# Altium schematic sheet Slave_Schematic.SchDoc
size A4 portrait; SheetNumber: 1; SheetTotal: 2
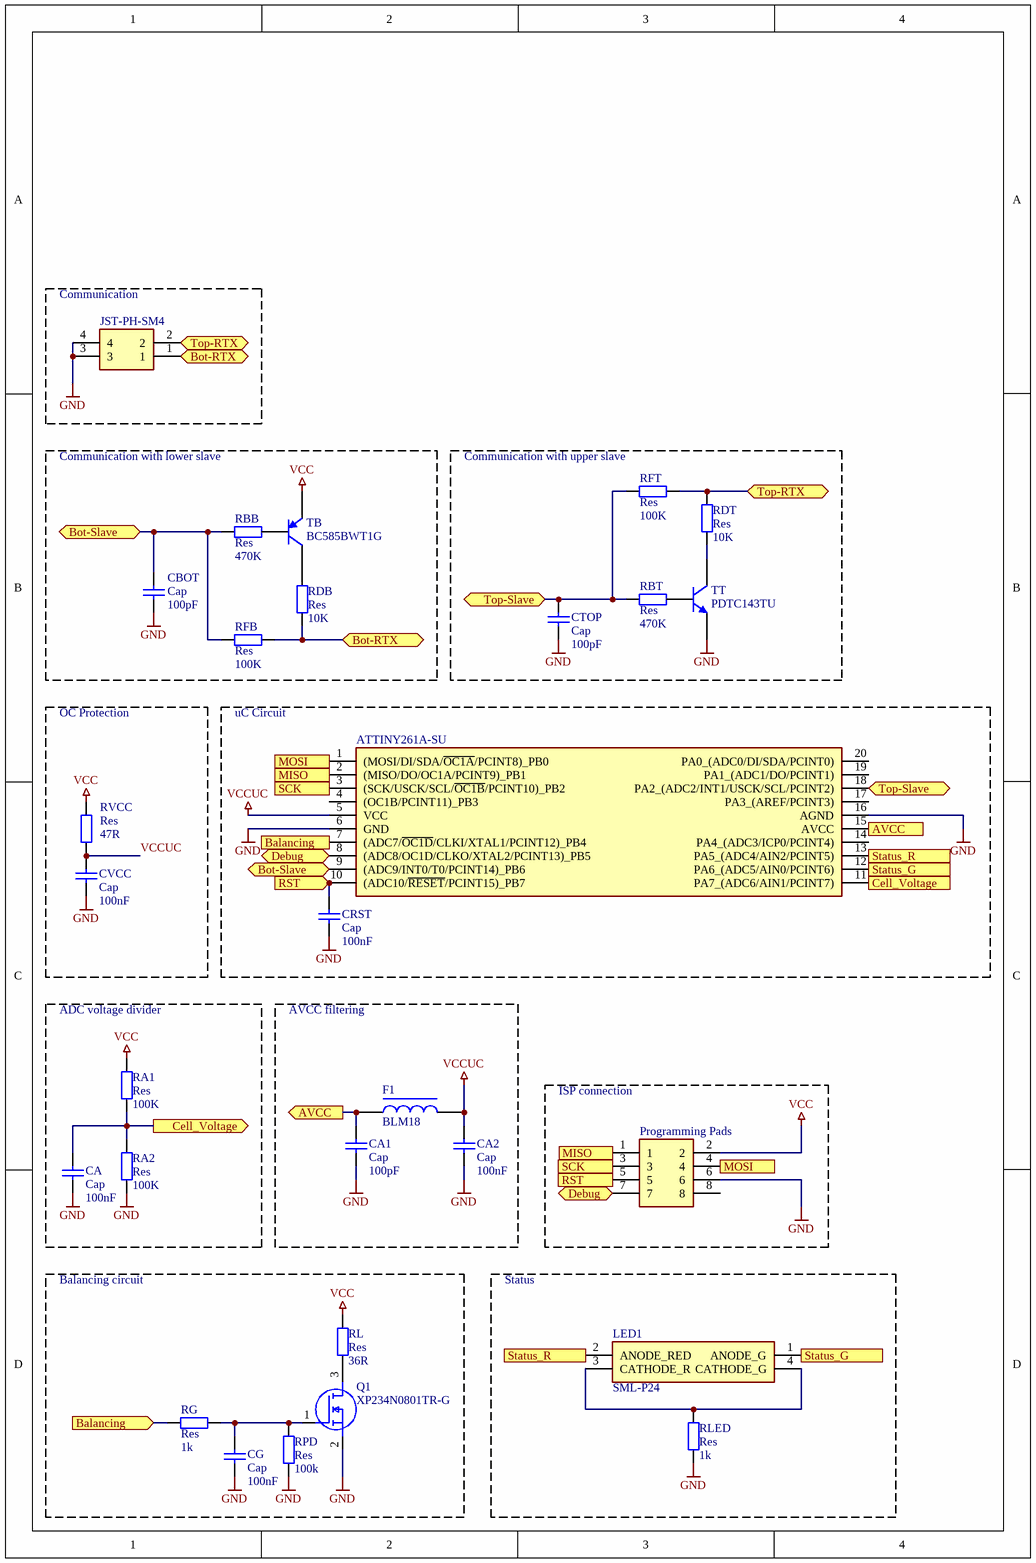
[diagram p0: Slave_Schematic.SchDoc]

## Parts
ATTINY261A-SU  ATTINY261A-SU  [TSSOP-20T (MO-153 AC)]  (value not drawn)
CA  Cap  value 100nF  [0603]
CA1  Cap  value 100pF  [0603]
CA2  Cap  value 100nF  [0603]
CBOT  Cap  value 100pF  [0603]
CG  Cap  value 100nF  [0603]
CRST  Cap  value 100nF  [0603]
CTOP  Cap  value 100pF  [0603]
CVCC  Cap  value 100nF  [0603]
F1  BLM18  [0603 - BLM18AG102BH1D]
JST-PH-SM4  B2B-PH-SM4  [JST-PHR]  (value not drawn)
LED1  SML-P24  [1010 LED]
Programming_Pads  Connector 2x4  [Pads 2X4]  (value not drawn)
Q1  XP234N0801TR-G  [SOT-23 (TO-236)]
RA1  Res  value 100K  [0603]
RA2  Res  value 100K  [0603]
RBB  Res  value 470K  [0603]
RBT  Res  value 470K  [0603]
RDB  Res  value 10K  [0603]
RDT  Res  value 10K  [0603]
RFB  Res  value 100K  [0603]
RFT  Res  value 100K  [0603]
RG  Res  value 1k  [0603]
RL  Res  value 36R  [1020 (Reversed)]
RLED  Res  value 1k  [0603]
RPD  Res  value 100k  [0603]
RVCC  Res  value 47R  [0603]
TB  BC585BWT1G  [SOT-323 (SC-70)]
TT  PDTC143TU  [SOT-323 (SC-70)]

## Blocks framed on the sheet
Communication: JST-PH-SM4
Communication with lower slave: CBOT RBB RDB RFB TB
Communication with upper slave: CTOP RBT RDT RFT TT
OC Protection: CVCC RVCC
uC Circuit: ATTINY261A-SU CRST
ADC voltage divider: CA RA1 RA2
AVCC filtering: CA1 CA2 F1
ISP connection: Programming_Pads
Balancing circuit: CG Q1 RG RL RPD
Status: LED1 RLED

## Ports
AVCC (in), AVCC (out), Balancing (in), Balancing (out), Bot-RTX (bidir), Bot-Slave (bidir), Cell_Voltage (in), Cell_Voltage (out), Debug (bidir), MISO (in), MISO (out), MOSI (in), MOSI (out), RST (in), RST (out), SCK (in), SCK (out), Status_G (in), Status_G (out), Status_R (in), Status_R (out), Top-RTX (bidir), Top-Slave (bidir)

## Nets
GND: ATTINY261A-SU.6(GND) ATTINY261A-SU.16(AGND) CA.1 CA1.1 CA2.1 CBOT.1 CG.1 CRST.1 CTOP.1 CVCC.1 JST-PH-SM4.3 JST-PH-SM4.4 Programming_Pads.6 Q1.2(S) RA2.1 RLED.1 RPD.1 TT.3(E)
VCC: Programming_Pads.2 RA1.2 RL.2 RVCC.2 TB.3(E)
VCCUC: ATTINY261A-SU.5(VCC) CA2.2 CVCC.2 F1.2 RVCC.1
AVCC: ATTINY261A-SU.15(AVCC) CA1.2 F1.1 ; port AVCC
Balancing: ATTINY261A-SU.7((ADC7/~{OC1D}/CLKI/XTAL1/PCINT12)_PB4) RG.1 ; port Balancing
Bot-RTX: JST-PH-SM4.1 RDB.1 RFB.2 ; port Bot-RTX
Bot-Slave: ATTINY261A-SU.9((ADC9/INT0/T0/PCINT14)_PB6) CBOT.2 RBB.1 RFB.1 ; port Bot-Slave
Cell_Voltage: ATTINY261A-SU.11(PA7_(ADC6/AIN1/PCINT7)) CA.2 RA1.1 RA2.2 ; port Cell_Voltage
Debug: ATTINY261A-SU.8((ADC8/OC1D/CLKO/XTAL2/PCINT13)_PB5) Programming_Pads.7 ; port Debug
MISO: ATTINY261A-SU.2((MISO/DO/OC1A/PCINT9)_PB1) Programming_Pads.1 ; port MISO
MOSI: ATTINY261A-SU.1((MOSI/DI/SDA/~{OC1A}/PCINT8)_PB0) Programming_Pads.4 ; port MOSI
RST: ATTINY261A-SU.10((ADC10/~{RESET}/PCINT15)_PB7) CRST.2 Programming_Pads.5 ; port RST
SCK: ATTINY261A-SU.3((SCK/USCK/SCL/~{OC1B}/PCINT10)_PB2) Programming_Pads.3 ; port SCK
Status_G: ATTINY261A-SU.12(PA6_(ADC5/AIN0/PCINT6)) LED1.1(ANODE_G) ; port Status_G
Status_R: ATTINY261A-SU.13(PA5_(ADC4/AIN2/PCINT5)) LED1.2(ANODE_RED) ; port Status_R
Top-RTX: JST-PH-SM4.2 RDT.2 RFT.2 ; port Top-RTX
Top-Slave: ATTINY261A-SU.18(PA2_(ADC2/INT1/USCK/SCL/PCINT2)) CTOP.2 RBT.1 RFT.1 ; port Top-Slave
NetCG_2: CG.2 Q1.1(G) RG.2 RPD.2
NetLED1_3: LED1.3(CATHODE_R) LED1.4(CATHODE_G) RLED.2
NetQ1_3: Q1.3(D) RL.1
NetRDB_2: RDB.2 TB.1(C)
NetRDT_1: RDT.1 TT.1(C)

Not connected (* = marked no-connect by the designer): ATTINY261A-SU 4((OC1B/PCINT11)_PB3) 14(PA4_(ADC3/ICP0/PCINT4)) 17(PA3_(AREF/PCINT3)) 19(PA1_(ADC1/DO/PCINT1)) 20(PA0_(ADC0/DI/SDA/PCINT0)); Programming_Pads 8; RBB 2; RBT 2; TB 2(B); TT 2(B)

## Library data of the parts
ATTINY261A-SU = ATTINY261A-SU: Integrated Circuit; Manufacturer_Name: Microchip; Datasheet Link: http://www.atmel.com/Images/doc8197.pdf; Height: 2.65mm; Manufacturer_Part_Number: ATTINY261A-SU; Mouser Part Number: 556-ATTINY261A-SU; Mouser Price/Stock: https://www.mouser.co.uk/ProductDetail/Microchip-Technology-Atmel/ATTINY261A-SU?qs=LHmEVA8xxfYkt4Dy%2F2AOtw%3D%3D; Arrow Part Number: ATTINY261A-SU; Arrow Price/Stock: https://www.arrow.com/en/products/attiny261a-su/microchip-technology
CA CA1 CA2 CBOT CG CRST CTOP CVCC = Cap: Capacitor; Published: 8-Jun-2000; LatestRevisionDate: 17-Jul-2002; LatestRevisionNote: Re-released for DXP Platform.; PackageReference: RAD-0.3; Publisher: Altium Limited; PackageDescription: Radial Cap, Thru-Hole; 2 Leads; 0.3 in Pin Spacing
F1 = BLM18: Filter
JST-PH-SM4 = B2B-PH-SM4-TB_LF__SN_: Connector; Manufacturer_Name: JST (JAPAN SOLDERLESS TERMINALS); Manufacturer_Part_Number: B2B-PH-SM4-TB(LF)(SN); Datasheet Link: http://www.jst-mfg.com/product/pdf/eng/ePH.pdf; Height: 6.6mm
LED1 = SML-P24: Dual Color LED; Manufacturer_Name: ROHM Semiconductor; Manufacturer_Part_Number: SML-P24MUWT86R; Datasheet Link: https://www.rohm.com/datasheet/SML-P24MUW(R)/sml-p24muw-e; Height: 0.25mm; Mouser Part Number: 755-SML-P24MUWT86R; Mouser Price/Stock: https://www.mouser.co.uk/ProductDetail/ROHM-Semiconductor/SML-P24MUWT86R?qs=SP2aZMzhwxgr8eZ6SbTI9w%3D%3D
Programming_Pads = Connector 2x4: Connector 1,27mm; Manufacturer_Name: Mill-Max; Manufacturer_Part_Number: 855-22-008-10-001101; Datasheet Link: https://componentsearchengine.com/Datasheets/2/855-22-008-10-001101.pdf; Height: 6.27mm; Mouser Part Number: 575-855-22-008-10; Mouser Price/Stock: https://www.mouser.co.uk/ProductDetail/Mill-Max/855-22-008-10-001101?qs=mPCt1EmoOdQMosTdRU7w4Q%3D%3D
Q1 = XP234N0801TR-G: MOSFET (N-Channel); Manufacturer_Name: Torex; Datasheet Link: https://4donline.ihs.com/images/VipMasterIC/IC/TOSL/TOSL-S-A0008892481/TOSL-S-A0008892481-1.pdf?hkey=CECEF36DEECDED6468708AAF2E19C0C6; Height: 1.15mm; Manufacturer_Part_Number: XP234N0801TR-G; Mouser Part Number: 865-XP234N0801TR-G; Mouser Price/Stock: https://www.mouser.co.uk/ProductDetail/Torex-Semiconductor/XP234N0801TR-G?qs=BJlw7L4Cy7%252BWe%2FbHvnXcKQ%3D%3D
RA1 RA2 RBB RBT RDB RDT RFB RFT RG RL RLED RPD RVCC = Res: Resistor; Published: 8-Jun-2000; LatestRevisionDate: 17-Jul-2002; LatestRevisionNote: Re-released for DXP Platform.; PackageReference: AXIAL-0.4; Publisher: Altium Limited; PackageDescription: Axial Device, Thru-Hole; 2 Leads; 0.4 in Pin Spacing
TB = BC585BWT1G: PNP; Published: 8-Jun-2000; LatestRevisionDate: 29-May-2009; LatestRevisionNote: IPC-7351 Footprint Added.; PackageVersion: Aug-1999; PackageReference: SOT-23B; Publisher: Altium Limited; PackageDescription: 3-Pin SOT-23 Package 0.95 mm Pitch, 2.4 mm Lead Span
TT = PDTC143TU: NPN; Published: 8-Jun-2000; LatestRevisionDate: 17-Jul-2002; LatestRevisionNote: Re-released for DXP Platform.; PackageReference: TO-226-AA; Publisher: Altium Limited; PackageDescription: TO, Flat Index; 3 In-Line, Axial Leads; Body Dia. 4.8mm; Leads 0.55 x 0.51 mm (max); Code_JEDEC: TO-226-AA